# Altium schematic sheet UART.SchDoc
size A; SheetNumber: 1; SheetTotal: 2
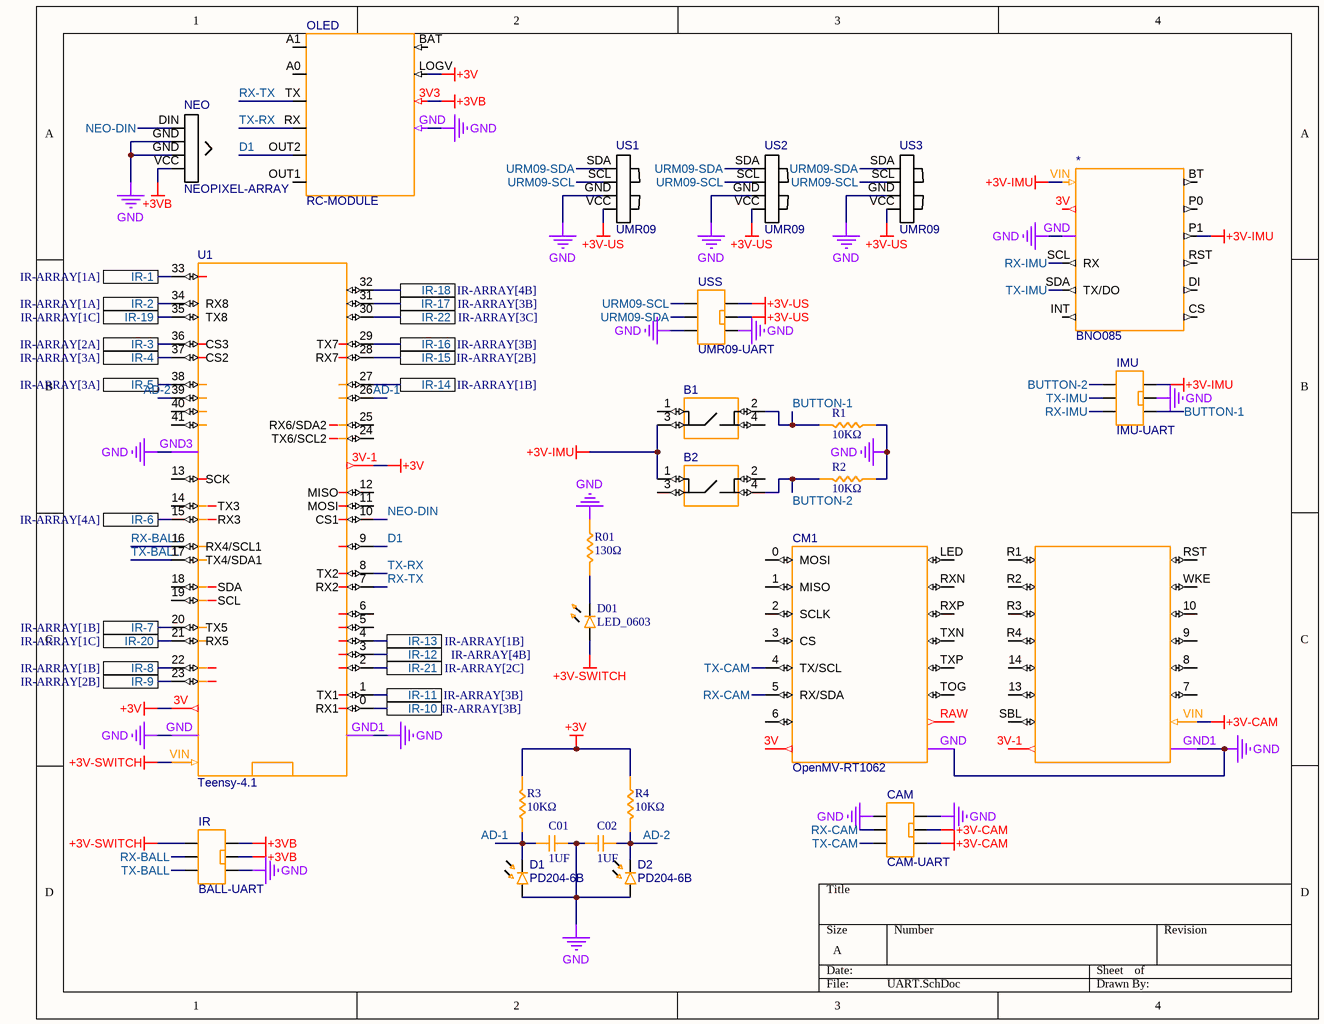
[diagram p0: UART.SchDoc]

## Parts
*  BNO085  [BNO085]
B1  BUTTON  [BUTTON]  (value not drawn)
B2  BUTTON  [BUTTON]  (value not drawn)
C01  1UF  [CAP_0603]
C02  1UF  [CAP_0603]
CAM  CAM-UART  [IDC-6PIN-SMT-2.54]
CM1  OpenMV-RT1062  [OpenMV-RT1062]
D1  PD204-6B  [PD204-6B]
D01  LED_0603  [LED_0603]
D2  PD204-6B  [PD204-6B]
IMU  IMU-UART  [IDC-6PIN-SMT-2.54]
IR  BALL-UART  [IDC-6PIN-SMT-2.54]
NEO  NEOPIXEL-ARRAY  [NEOPIXEL-ARRAY]
OLED  RC-MODULE  [RC-MODULE]
R1  10KΩ  [RES_0603]
R01  130Ω  [RES_0603]
R2  10KΩ  [RES_0603]
R3  10KΩ  [RES_0603]
R4  10KΩ  [RES_0603]
U1  Teensy-4.1  [Teensy-4.1]
US1  UMR09  [URM09]
US2  UMR09  [URM09]
US3  UMR09  [URM09]
USS  UMR09-UART  [IDC-6PIN-SMT-2.54]

## Ports
IR-1 (see IR-ARRAY[1A]), IR-2 (see IR-ARRAY[1A]), IR-3 (see IR-ARRAY[2A]), IR-4 (see IR-ARRAY[3A]), IR-5 (see IR-ARRAY[3A]), IR-6 (see IR-ARRAY[4A]), IR-7 (see IR-ARRAY[1B]), IR-8 (see IR-ARRAY[1B]), IR-9 (see IR-ARRAY[2B]), IR-10 (see IR-ARRAY[3B]), IR-11 (see IR-ARRAY[3B]), IR-12 (see IR-ARRAY[4B]), IR-13 (see IR-ARRAY[1B]), IR-14 (see IR-ARRAY[1B]), IR-15 (see IR-ARRAY[2B]), IR-16 (see IR-ARRAY[3B]), IR-17 (see IR-ARRAY[3B]), IR-18 (see IR-ARRAY[4B]), IR-19 (see IR-ARRAY[1C]), IR-20 (see IR-ARRAY[1C]), IR-21 (see IR-ARRAY[2C]), IR-22 (see IR-ARRAY[3C])

## Nets
+3V: OLED.LOGV R3.1 R4.2 U1.3V U1.3V-1
+3V-CAM: CAM.4 CAM.5 CM1.VIN
+3V-IMU: *.P1 *.VIN B1.3 B2.1 IMU.6
+3V-SWITCH: D01.A IR.1 U1.VIN
+3V-US: US1.VCC US2.VCC US3.VCC USS.5 USS.6
+3VB: IR.5 IR.6 NEO.VCC OLED.3V3
GND: *.GND C01.1 C02.1 CAM.1 CAM.6 CM1.GND CM1.GND1 D1.A D2.A IMU.5 IR.4 NEO.GND OLED.GND R1.2 R01.2 R2.2 U1.GND U1.GND1 U1.GND3 US1.GND US2.GND US3.GND USS.3 USS.4
AD-1: C01.2 D1.C R3.2 U1.26
AD-2: C02.2 D2.C R4.1 U1.39
BUTTON-1: B1.2 IMU.4 R1.1
BUTTON-2: B2.4 IMU.1 R2.1
D1: OLED.OUT2 U1.9
IR-1: U1.33 ; port IR-1
IR-2: U1.34(RX8) ; port IR-2
IR-3: U1.36(CS3) ; port IR-3
IR-4: U1.37(CS2) ; port IR-4
IR-5: U1.38 ; port IR-5
IR-6: U1.15(RX3) ; port IR-6
IR-7: U1.20(TX5) ; port IR-7
IR-8: U1.22 ; port IR-8
IR-9: U1.23 ; port IR-9
IR-10: U1.0(RX1) ; port IR-10
IR-11: U1.1(TX1) ; port IR-11
IR-12: U1.3 ; port IR-12
IR-13: U1.4 ; port IR-13
IR-14: U1.27 ; port IR-14
IR-15: U1.28(RX7) ; port IR-15
IR-16: U1.29(TX7) ; port IR-16
IR-17: U1.31 ; port IR-17
IR-18: U1.32 ; port IR-18
IR-19: U1.35(TX8) ; port IR-19
IR-20: U1.21(RX5) ; port IR-20
IR-21: U1.2 ; port IR-21
IR-22: U1.30 ; port IR-22
NEO-DIN: NEO.DIN U1.10(CS1)
RX-BALL: IR.2 U1.16(RX4/SCL1)
RX-CAM: CAM.2 CM1.5(RX/SDA)
RX-IMU: *.SCL(RX) IMU.3
RX-TX: OLED.TX U1.7(RX2)
TX-BALL: IR.3 U1.17(TX4/SDA1)
TX-CAM: CAM.3 CM1.4(TX/SCL)
TX-IMU: *.SDA(TX/DO) IMU.2
TX-RX: OLED.RX U1.8(TX2)
URM09-SCL: US1.SCL US2.SCL US3.SCL USS.1
URM09-SDA: US1.SDA US2.SDA US3.SDA USS.2
NetD01_C: D01.C R01.1

Not connected (* = marked no-connect by the designer): * 3V BT CS DI INT P0 RST; B1 1 4; B2 2 3; CM1 0(MOSI) 1(MISO) 2(SCLK) 3(CS) 3V 3V-1 6 7 8 9 10 13 14 LED R1 R2 R3 R4 RAW RST RXN RXP SBL TOG TXN TXP WKE; OLED A0 A1 BAT OUT1; U1 5 6 11(MOSI) 12(MISO) 13(SCK) 14(TX3) 18(SDA) 19(SCL) 24(TX6/SCL2) 25(RX6/SDA2) 40 41

## Library data of the parts
C01 C02 = CAP_0603: Capacitor SMD 0603 generic
CAM IMU IR USS = IDC-6PIN-SMT-2.54_1_1
R1 R01-R4 = RES_0603: Resistor SMD 0603 generic